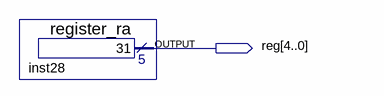
[diagram p0: schematic sheet]
// Quartus schematic teste_ra.bdf as structural Verilog: 1 symbols, 1 pins
module teste_ra (
  output [4:0] \reg 
);

  register_ra inst28 (.result(\reg ));
endmodule
